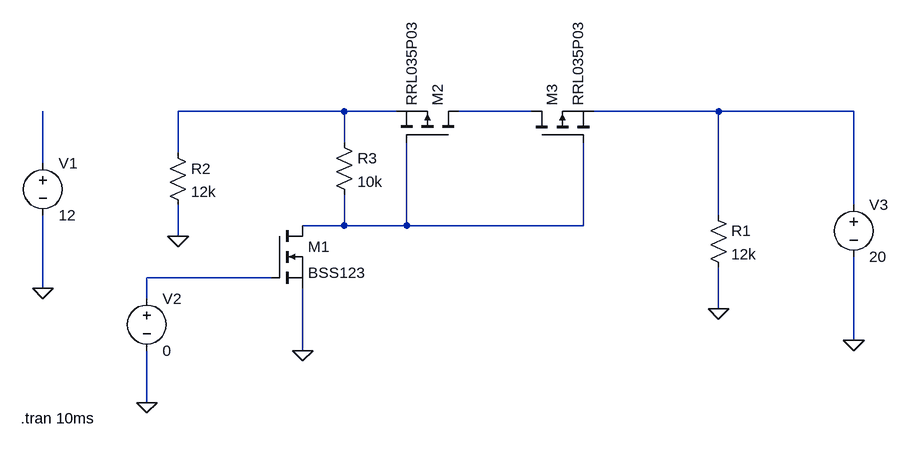
[diagram p0: schematic Draft1.asc]
Draft1.asc, the LTspice schematic file:
Version 4
SHEET 1 1080 680
WIRE 240 -48 -16 -48
WIRE 320 -48 240 -48
WIRE 528 -48 416 -48
WIRE 816 -48 624 -48
WIRE 1024 -48 816 -48
WIRE 240 0 240 -48
WIRE -16 16 -16 -48
WIRE -224 32 -224 -48
WIRE 1024 96 1024 -48
WIRE 816 112 816 -48
WIRE 240 128 240 80
WIRE 240 128 176 128
WIRE 336 128 336 0
WIRE 336 128 240 128
WIRE 608 128 608 0
WIRE 608 128 336 128
WIRE -16 144 -16 96
WIRE 128 208 -64 208
WIRE -224 224 -224 112
WIRE -64 240 -64 208
WIRE 816 256 816 192
WIRE 1024 304 1024 176
WIRE 176 320 176 224
WIRE -64 400 -64 320
FLAG 176 320 0
FLAG -64 400 0
FLAG -224 224 0
FLAG 1024 304 0
FLAG -16 144 0
FLAG 816 256 0
SYMBOL nmos 128 128 R0
SYMATTR InstName M1
SYMATTR Value BSS123
SYMBOL pmos 416 0 M270
SYMATTR InstName M2
SYMATTR Value RRL035P03
SYMBOL pmos 528 0 R270
SYMATTR InstName M3
SYMATTR Value RRL035P03
SYMBOL voltage -224 16 R0
SYMATTR InstName V1
SYMATTR Value 12
SYMBOL voltage -64 224 R0
SYMATTR InstName V2
SYMATTR Value 0
SYMBOL voltage 1024 80 R0
SYMATTR InstName V3
SYMATTR Value 20
SYMBOL res 800 96 R0
SYMATTR InstName R1
SYMATTR Value 12k
SYMBOL res -32 0 R0
SYMATTR InstName R2
SYMATTR Value 12k
SYMBOL res 224 -16 R0
SYMATTR InstName R3
SYMATTR Value 10k
TEXT -258 424 Left 2 !.tran 10ms

The netlist it stands for:
* Draft1.asc
M1 N005 N006 0 0 BSS123
M2 N002 N005 N001 N001 RRL035P03
M3 N002 N005 N003 N003 RRL035P03
V1 N004 0 12
V2 N006 0 0
V3 N003 0 20
R1 N003 0 12k
R2 N001 0 12k
R3 N001 N005 10k
.model NMOS NMOS
.model PMOS PMOS
.lib standard.mos
.tran 10ms
.backanno
.end